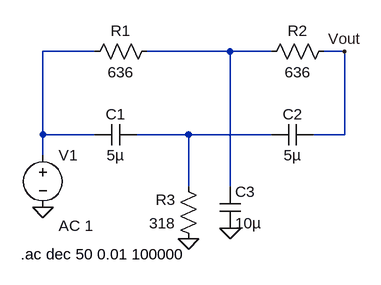
[diagram p0: schematic Rechaza banda pasivo R-C.asc]
Rechaza banda pasivo R-C.asc, the LTspice schematic file:
Version 4
SHEET 1 880 680
WIRE 160 -32 80 -32
WIRE 368 -32 240 -32
WIRE 432 -32 368 -32
WIRE 544 -32 512 -32
WIRE 80 96 80 -32
WIRE 160 96 80 96
WIRE 304 96 224 96
WIRE 432 96 304 96
WIRE 544 96 544 -32
WIRE 544 96 496 96
WIRE 80 128 80 96
WIRE 304 176 304 96
WIRE 368 176 368 -32
FLAG 80 208 0
FLAG 304 256 0
FLAG 368 240 0
FLAG 544 -32 Vout
SYMBOL voltage 80 112 R0
WINDOW 123 24 124 Left 2
WINDOW 39 0 0 Left 0
SYMATTR InstName V1
SYMATTR Value ""
SYMATTR Value2 AC 1
SYMBOL cap 224 80 R90
WINDOW 0 0 32 VBottom 2
WINDOW 3 32 32 VTop 2
SYMATTR InstName C1
SYMATTR Value 5µ
SYMBOL cap 496 80 R90
WINDOW 0 0 32 VBottom 2
WINDOW 3 32 32 VTop 2
SYMATTR InstName C2
SYMATTR Value 5µ
SYMBOL cap 352 176 R0
SYMATTR InstName C3
SYMATTR Value 10µ
SYMBOL res 256 -48 R90
WINDOW 0 0 56 VBottom 2
WINDOW 3 32 56 VTop 2
SYMATTR InstName R1
SYMATTR Value 636
SYMBOL res 528 -48 R90
WINDOW 0 0 56 VBottom 2
WINDOW 3 32 56 VTop 2
SYMATTR InstName R2
SYMATTR Value 636
SYMBOL res 320 272 R180
WINDOW 0 36 76 Left 2
WINDOW 3 36 40 Left 2
SYMATTR InstName R3
SYMATTR Value 318
TEXT 46 280 Left 2 !.ac dec 50 0.01 100000

The netlist it stands for:
* Rechaza banda pasivo R-C.asc
V1 N001 0 AC 1
C1 N003 N001 5µ
C2 Vout N003 5µ
C3 N002 0 10µ
R1 N002 N001 636
R2 Vout N002 636
R3 0 N003 318
.ac dec 50 0.01 100000
.backanno
.end